# EAGLE design master_05 (EAGLE 5.06)
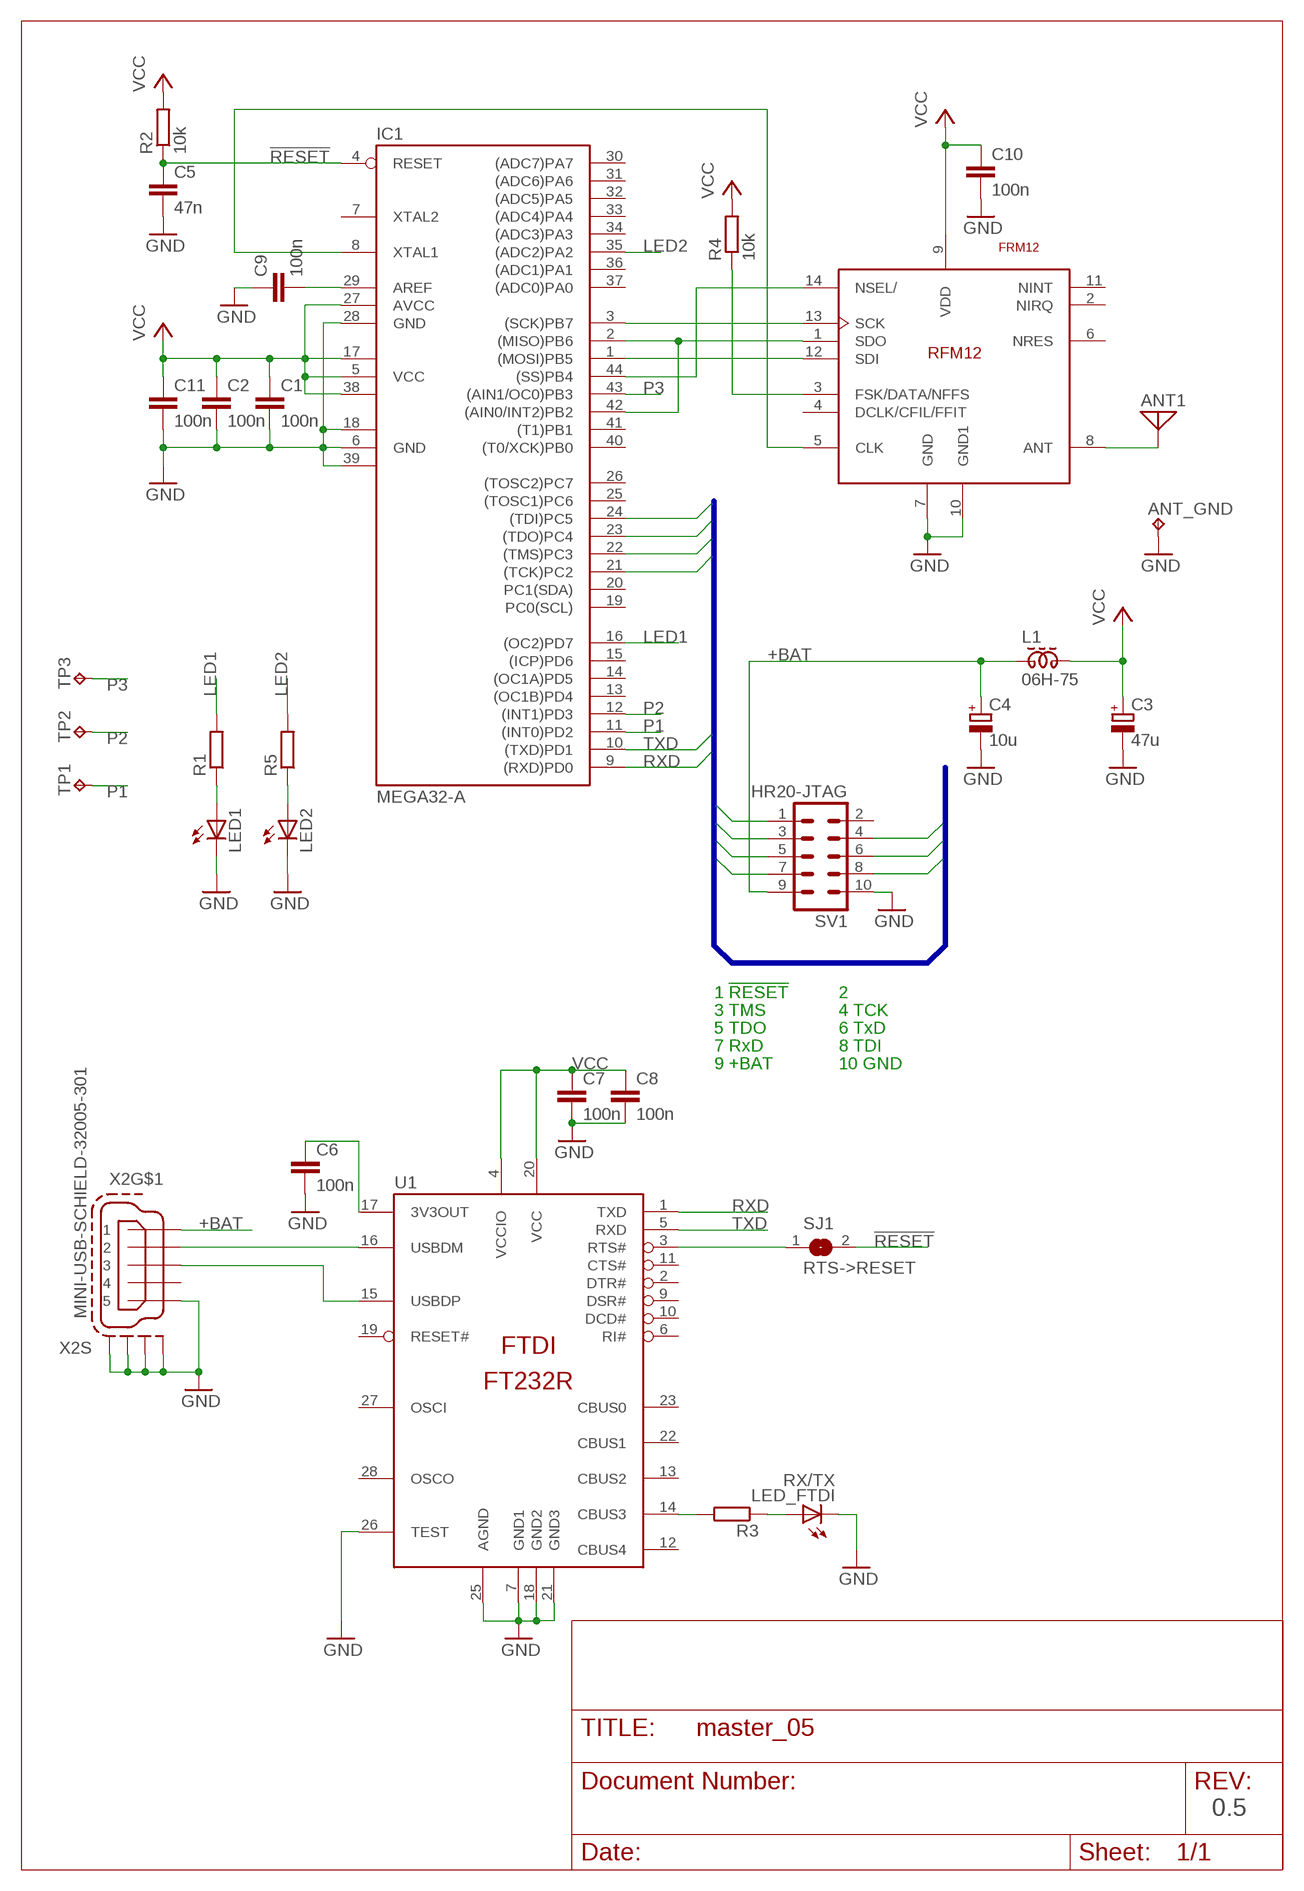
[diagram p0: schematic, sheet 1]

## Parts
ANT1  ANT  [PAD-01]
ANT_GND  TPTP20SQ  [TP20SQ]
C1  100n  C-EUC0603  [C0603]
C2  100n  C-EUC0603  [C0603]
C3  47u  CPOL-EUSMCD  [SMC_D]
C4  10u  CPOL-EUSMCD  [SMC_D]
C5  47n  C-EUC0603  [C0603]
C6  100n  C-EUC0603  [C0603]
C7  100n  C-EUC0603  [C0603]
C8  100n  C-EUC0603  [C0603]
C9  100n  C-EUC0603  [C0603]
C10  100n  C-EUC0603  [C0603]
C11  100n  C-EUC0603  [C0603]
IC1  MEGA32-A  [TQFP44]
L1  06H-75  ZD60820512  [ZD6-2W5]
LED1  LEDCHIPLED_0603  [CHIPLED_0603]
LED2  LEDCHIPLED_0603  [CHIPLED_0603]
LED_FTDI  RX/TX  LEDCHIPLED_0603  [CHIPLED_0603]
R1  R-EU_R0603  [R0603]
R2  10k  R-EU_R0603  [R0603]
R3  R-EU_R0603  [R0603]
R4  10k  R-EU_R0603  [R0603]
R5  R-EU_R0603  [R0603]
SJ1  RTS->RESET  SJ  [SJ]
SV1  HR20-JTAG  MA05-2  [MA05-2]
TP1  TP1-13  [P1-13]
TP2  TP1-13  [P1-13]
TP3  TP1-13  [P1-13]
U1  FT232RL  [SSOP28DB]
U$1  FRM12  [RFM12]
X2  MINI-USB-SCHIELD-32005-301  [32005-301]

## Nets
!RESET: C5.1 IC1.4(RESET) R2.1 SJ1.2 SV1.1
+BAT: C4.+ L1.1 SV1.9 X2.1
GND: ANT_GND.TP C1.2 C2.2 C3.- C4.- C5.2 C6.2 C7.2 C8.2 C9.1 C10.2 C11.2 IC1.6(GND) IC1.18(GND1) IC1.28(GND) IC1.39(GND2) LED1.C LED2.C LED_FTDI.C SV1.10 U1.7(GND1) U1.18(GND2) U1.21(GND3) U1.25(AGND) U1.26(TEST) U$1.7(GND) U$1.10(GND1) X2.5 X2.M1(S:S1) X2.M2(S:S2) X2.M3(S:S3) X2.M4(S:S4)
LED1: IC1.16((OC2)PD7) R1.2
LED2: IC1.35((ADC2)PA2) R5.2
N$1: IC1.2((MISO)PB6) IC1.42((AIN0/INT2)PB2) U$1.1(SDO)
N$2: IC1.1((MOSI)PB5) U$1.12(SDI)
N$3: IC1.3((SCK)PB7) U$1.13(SCK)
N$4: IC1.44((SS)PB4) U$1.14(NSEL/)
N$5: R4.1 U$1.3(FSK/DATA/NFFS)
N$6: IC1.8(XTAL1) U$1.5(CLK)
N$7: U1.16(USBDM) X2.2
N$8: U1.15(USBDP) X2.3
N$9: C6.1 U1.17(3V3OUT)
N$10: LED_FTDI.A R3.1
N$11: R3.2 U1.14(CBUS3)
N$12: LED1.A R1.1
N$13: LED2.A R5.1
N$14: SJ1.1 U1.3(RTS#)
N$15: C9.2 IC1.29(AREF)
N$17: ANT1.1(TP) U$1.8(ANT)
P1: IC1.11((INT0)PD2) TP1.1(TP)
P2: IC1.12((INT1)PD3) TP2.1(TP)
P3: IC1.43((AIN1/OC0)PB3) TP3.1(TP)
RXD: IC1.9((RXD)PD0) SV1.7 U1.1(TXD)
TCK: IC1.21((TCK)PC2) SV1.4
TDI: IC1.24((TDI)PC5) SV1.8
TDO: IC1.23((TDO)PC4) SV1.5
TMS: IC1.22((TMS)PC3) SV1.3
TXD: IC1.10((TXD)PD1) SV1.6 U1.5(RXD)
VCC: C1.1 C2.1 C3.+ C7.1 C8.1 C10.1 C11.1 IC1.5(VCC) IC1.17(VCC1) IC1.27(AVCC) IC1.38(VCC2) L1.2 R2.2 R4.2 U1.4(VCCIO) U1.20(VCC) U$1.9(VDD)
Unconnected: IC1.7(XTAL2) IC1.13((OC1B)PD4) IC1.14((OC1A)PD5) IC1.15((ICP)PD6) IC1.19(PC0(SCL)) IC1.20(PC1(SDA)) IC1.25((TOSC1)PC6) IC1.26((TOSC2)PC7) IC1.30((ADC7)PA7) IC1.31((ADC6)PA6) IC1.32((ADC5)PA5) IC1.33((ADC4)PA4) IC1.34((ADC3)PA3) IC1.36((ADC1)PA1) IC1.37((ADC0)PA0) IC1.40((T0/XCK)PB0) IC1.41((T1)PB1) SV1.2 U1.2(DTR#) U1.6(RI#) U1.9(DSR#) U1.10(DCD#) U1.11(CTS#) U1.12(CBUS4) U1.13(CBUS2) U1.19(RESET#) U1.22(CBUS1) U1.23(CBUS0) U1.27(OSCI) U1.28(OSCO) U$1.2(NIRQ) U$1.4(DCLK/CFIL/FFIT) U$1.6(NRES) U$1.11(NINT) X2.4

## Buses
IO:!RESET,TMS,TCK,TDO,TXD,RXD,TDI

## Notes on the sheet
- 1 !RESET | 2
- 3 TMS | 4 TCK
- 5 TDO | 6 TxD
- 7 RxD | 8 TDI
- 9 +BAT | 10 GND
- 0.5

## Library data of the parts
ANT1 = OpenHR20_master:ANT
ANT_GND = testpad:TP: Test pad
C1 C2 C5-C11 = resistor:C-EU: CAPACITOR, European symbol
C3 C4 = resistor:CPOL-EU: POLARIZED CAPACITOR, European symbol
IC1 = atmel:MEGA32: MICROCONTROLLER 32 Kbytes FLASH 2 Kbytes SRAM 1 Kbytes EEPROM USART 8-channel 10 bit ADC Source: www.atmel.com .. doc2503.pdf
L1 = OpenHR20_master:ZD60820512: WIDE-BAND CHOKE 2.5 windings
LED1 LED2 LED_FTDI = led:LED: LED OSRAM: - CHIPLED LG R971, LG N971, LY N971, LG Q971, LY Q971, LO R971, LY R971 LH N974, LH R974 LS Q976, LO Q976, LY Q976 LO Q996 - Hyper CHIPLED LW Q18S LB Q993, LB Q99A, LB R99A - SideLED LS A670, LO A670, LY A670, LG A670, LP A670 LB A673, LV A673, LT A673, LW A673 LH A674 LY A675 LS A676, LA A676, LO A676, LY A676, LW A676 LS A679, LY A679, LG A679 - Hyper Micro SIDELED® LS Y876, LA Y876, LO Y876, LY Y876 LT Y87S - SmartLED LW L88C, LW L88S LB L89C, LB L89S, LG L890 LS L89K, LO L89K, LY L89K LS L896, LA L896, LO L896, LY L896 - TOPLED LS T670, LO T670, LY T670, LG T670, LP T670 LSG T670, LSP T670, LSY T670, LOP T670, LYG T670 LG T671, LOG T671, LSG T671 LB T673, LV T673, LT T673, LW T673 LH T674 LS T676, LA T676, LO T676, LY T676, LB T676, LH T676, LSB T676, LW T676 LB T67C, LV T67C, LT T67C, LS T67K, LO T67K, LY T67K, LW E67C LS E67B, LA E67B, LO E67B, LY E67B, LB E67C, LV E67C, LT E67C LW T67C LS T679, LY T679, LG T679 LS T770, LO T770, LY T770, LG T770, LP T770 LB T773, LV T773, LT T773, LW T773 LH T774 LS E675, LA E675, LY E675, LS T675 LS T776, LA T776, LO T776, LY T776, LB T776 LHGB T686 LT T68C, LB T68C - Hyper Mini TOPLED® LB M676 - Mini TOPLED Santana® LG M470 LS M47K, LO M47K, LY M47K Source: http://www.osram.convergy.de LUXEON: - LUMILED® LXK2-PW12-R00, LXK2-PW12-S00, LXK2-PW14-U00, LXK2-PW14-V00 LXK2-PM12-R00, LXK2-PM12-S00, LXK2-PM14-U00 LXK2-PE12-Q00, LXK2-PE12-R00, LXK2-PE12-S00, LXK2-PE14-T00, LXK2-PE14-U00 LXK2-PB12-K00, LXK2-PB12-L00, LXK2-PB12-M00, LXK2-PB14-N00, LXK2-PB14-P00, LXK2-PB14-Q00 LXK2-PR12-L00, LXK2-PR12-M00, LXK2-PR14-Q00, LXK2-PR14-R00 LXK2-PD12-Q00, LXK2-PD12-R00, LXK2-PD12-S00 LXK2-PH12-R00, LXK2-PH12-S00 LXK2-PL12-P00, LXK2-PL12-Q00, LXK2-PL12-R00 Source: www.luxeon.com KINGBRIGHT: KA-3528ASYC Source: www.kingbright.com
R1-R5 = resistor:R-EU_: RESISTOR, European symbol
SJ1 = jumper:SJ: SMD solder JUMPER
SV1 = OpenHR20_master:MA05-2: PIN HEADER
TP1-TP3 = OpenHR20_master:TP
U1 = ftdichip-3:FT232RL: USB UART 4th Generation USB UART (USB <-> Serial) Controller
U$1 = RFM12:FRM12
X2 = con-cypressindustries:MINI-USB-SCHIELD-: MINI USB-B Conector Source: www.cypressindustries.com

## Board
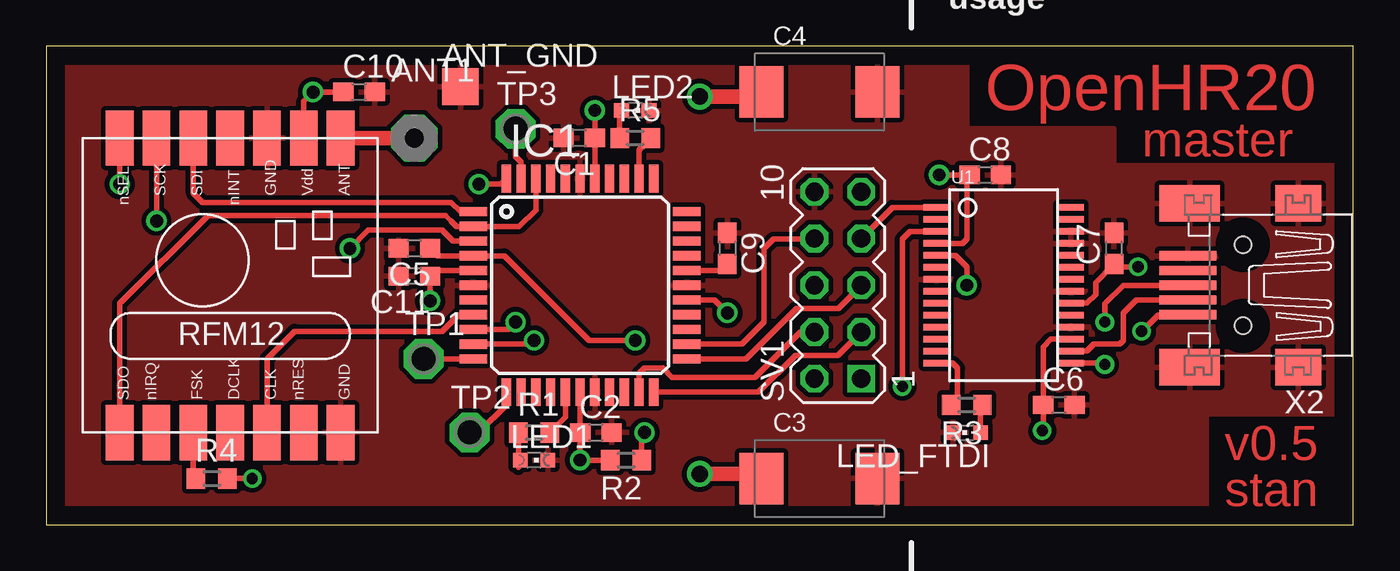
[diagram p1: board, top side]
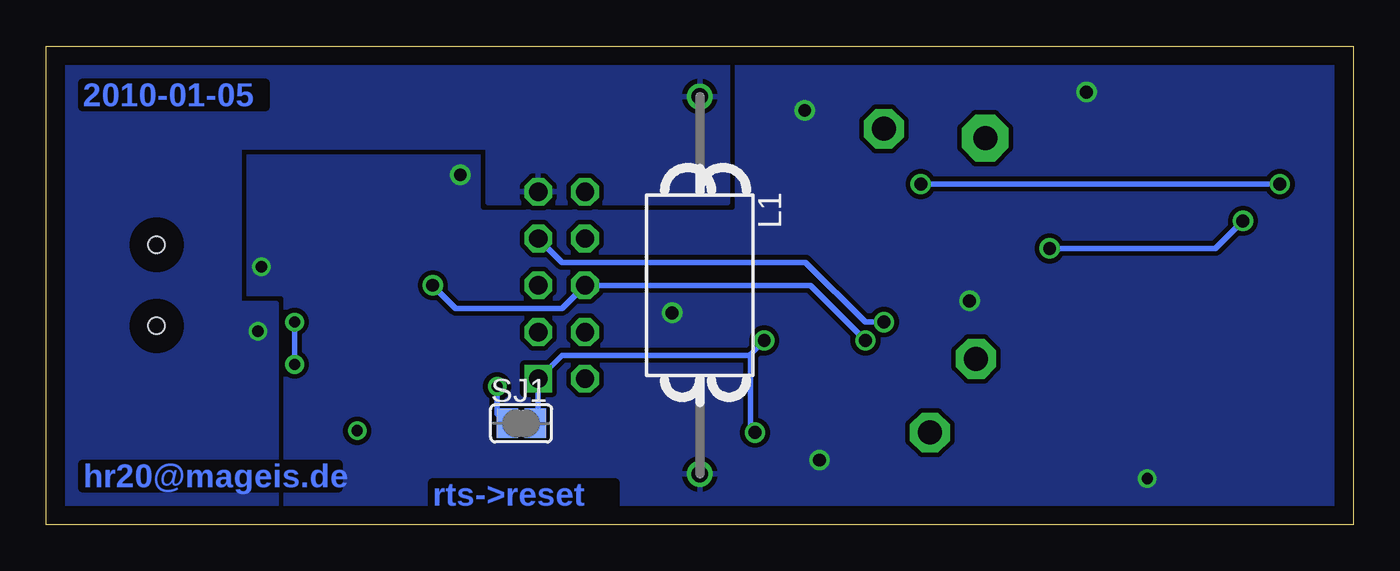
[diagram p2: board, bottom side, seen from below]

Size 71 x 26 mm. Coordinates in mm from the lower left corner, seen from the top.
Outline: 0,0 71,0 71,26 0,26 0,0
Copper layers (1*16): Top 0.035mm / dielectric 1.5mm / Bottom 0.035mm
Design rules "Olimex 10mils": minimum track width 10mil, minimum drill 24mil, track to track 10mil, track to pad 10mil, pad to pad 10mil, via to via 10mil, smd to smd 10mil, copper to edge 40mil, drill to drill 10mil, minimum pad ring 10mil, minimum via ring 8mil, stop-mask expansion 0mil, vias tented up to drill 0mil, thermal gap 10mil

### Footprints (pad centres in the part's own frame; a part is rotated, then mirrored left to right if it is on the bottom)
PAD-01 = drill 1.3 pad 2.54 octagon: 1 0,0
TP20SQ = smd 2 x 2: TP 0,0
C0603 = smd 1.1 x 1: 1 -0.85,0; 2 0.85,0
SMC_D = smd 2.4 x 2.8: + -3.15,0; - 3.15,0
TQFP44 = smd 1.5 x 0.5: 1 -5.8,4; 2 -5.8,3.2; 3 -5.8,2.4; 4 -5.8,1.6; 5 -5.8,0.8; 6 -5.8,0; 7 -5.8,-0.8; 8 -5.8,-1.6; 9 -5.8,-2.4; 10 -5.8,-3.2; 11 -5.8,-4; 23 5.8,-4; 24 5.8,-3.2; 25 5.8,-2.4; 26 5.8,-1.6; 27 5.8,-0.8; 28 5.8,0; 29 5.8,0.8; 30 5.8,1.6; 31 5.8,2.4; 32 5.8,3.2; 33 5.8,4 | smd 0.5 x 1.5: 12 -4,-5.8; 13 -3.2,-5.8; 14 -2.4,-5.8; 15 -1.6,-5.8; 16 -0.8,-5.8; 17 0,-5.8; 18 0.8,-5.8; 19 1.6,-5.8; 20 2.4,-5.8; 21 3.2,-5.8; 22 4,-5.8; 34 4,5.8; 35 3.2,5.8; 36 2.4,5.8; 37 1.6,5.8; 38 0.8,5.8; 39 0,5.8; 40 -0.8,5.8; 41 -1.6,5.8; 42 -2.4,5.8; 43 -3.2,5.8; 44 -4,5.8
ZD6-2W5 = drill 0.9 round: 1 -10.255,0; 2 10.255,0
CHIPLED_0603 = smd 0.8 x 0.8: A 0,-0.75; C 0,0.75
R0603 = smd 1 x 1.1: 1 -0.85,0; 2 0.85,0
SJ = smd 1.168 x 1.6: 1 -0.762,0; 2 0.762,0
MA05-2 = drill 1 square: 1 -5.08,-1.27 | drill 1 octagon: 2 -5.08,1.27; 3 -2.54,-1.27; 4 -2.54,1.27; 5 0,-1.27; 6 0,1.27; 7 2.54,-1.27; 8 2.54,1.27; 9 5.08,-1.27; 10 5.08,1.27
P1-13 = drill 1.3 pad 2.159 octagon: 1 0,0
SSOP28DB = smd 0.348 x 1.397: 1 -4.225,-3.656; 2 -3.575,-3.656; 3 -2.925,-3.656; 4 -2.275,-3.656; 5 -1.625,-3.656; 6 -0.975,-3.656; 7 -0.325,-3.656; 8 0.325,-3.656; 9 0.975,-3.656; 10 1.625,-3.656; 11 2.275,-3.656; 12 2.925,-3.656; 13 3.575,-3.656; 14 4.225,-3.656; 15 4.225,3.656; 16 3.575,3.656; 17 2.925,3.656; 18 2.275,3.656; 19 1.625,3.656; 20 0.975,3.656; 21 0.325,3.656; 22 -0.325,3.656; 23 -0.975,3.656; 24 -1.625,3.656; 25 -2.275,3.656; 26 -2.925,3.656; 27 -3.575,3.656; 28 -4.225,3.656
RFM12 = smd 1.5 x 3: 1 -5,-10; 2 -3,-10; 3 -1,-10; 4 1,-10; 5 3,-10; 6 5,-10; 7 7,-10; 8 7,6; 9 5,6; 10 3,6; 11 1,6; 12 -1,6; 13 -3,6; 14 -5,6
32005-301 = smd 3.1 x 0.5: 1 3,1.6; 2 3,0.8; 3 3,0; 4 3,-0.8; 5 3,-1.6 | smd 2.5 x 2: M1 -3,-4.45; M2 -3,4.45 | smd 3.3 x 2: M3 2.9,4.45; M4 2.9,-4.45 | hole 0.9: 0,2.2; 0,-2.2

### Placement (x,y rotation side)
ANT1  20,21 0 top
ANT_GND  22.5,23.8 0 top
C1  28.95,21 180 top
C2  29.86,5 0 top
C3  42,2.5 0 top
C4  42,23.5 0 top
C5  20,15 180 top
C6  55,6.5 0 top
C7  58,15 90 top
C8  51,19 0 top
C9  37,15 270 top
C10  17,23.5 0 top
C11  20,13.5 180 top
IC1  29,13 0 top
L1  35.5,13 270 bottom
LED1  26.5,3.5 270 top
LED2  32,22.5 270 top
LED_FTDI  50,5 90 top
R1  26.5,5 0 top
R2  31.5,3.5 180 top
R3  50,6.5 180 top
R4  9,2.5 0 top
R5  32,21 0 top
SJ1  45.2,5.5 0 bottom
SV1  43,13 90 top
TP1  20.5,9 0 top
TP2  23,5 0 top
TP3  25.5,21.5 0 top
U1  52,13 270 top
U$1  9,15 0 top
X2  65,13 180 top

### Tracks (layer width: path | path; a pad name or v marks a point on that pad's centre or on a via)
!RESET  (via drill 0.7)
  Top 0.3: C5.1 21.25,14.6 IC1.4 24.9,14.6 29.5,10 v32,10 | R2.1 32.35,4.85 v32.5,5
  Bottom 0.3: v32,10 32.75,9.25 | 32.75,9.25 32.8,9.2 42.99,9.2 SV1.1 44.27,5.67 SJ1.2 | v32.5,5 32.75,5.25 32.75,9.25
+BAT  (via drill 0.61)
  Top 0.3: X2.1 60.4,11.4 v59.5,10.5
  Top 0.8: L1.1 38.1,23.25 C4.+
  pour Bottom (rank 2): 70.5,26 34,26 34,17.5 47,17.5 47,20.5 60.5,20.5 60.5,12 58.5,12 58.5,0 70.5,0
GND
  pour Top: 0,26 50,26 50,21.5 58,21.5 58,19.5 70.5,19.5 70.5,6 63,6 63,0 0,0
LED1
  Top 0.3: R1.2 28.2,5.85 IC1.16
LED2
  Top 0.3: IC1.35 32.2,20.35 R5.2
N$1
  Top 0.254: 21.7,16.8 22,16.5
  Top 0.3: U$1.1 4,12 8.8,16.8 21.7,16.8 | IC1.42 26.6,17.1 25.7,16.2 IC1.2 22.3,16.2 22,16.5
N$2
  Top 0.254: 22.5,17 IC1.1
  Top 0.3: U$1.12 8,18 8.5,17.5 22,17.5 22.5,17
N$3  (via drill 0.7)
  Top 0.3: IC1.3 22.1,15.4 21.5,16 17.5,16 v16.5,15 | v6,16.5 U$1.13
  Bottom 0.3: v6,16.5 7.5,15 v16.5,15
N$4  (via drill 0.7)
  Top 0.3: v4,18.5 U$1.14 | v23.5,18.5 24.7,18.5 IC1.44
  Bottom 0.3: v4,18.5 v23.5,18.5
N$5
  Top 0.3: U$1.3 8,2.15 R4.1
N$6
  Top 0.3: IC1.8 22.4,11.4 21.5,10.5 13.5,10.5 12,9 U$1.5
N$7
  Top 0.3: X2.2 59.2,12.2 58.5,11.5 58.5,10 58.3,9.8 56.9,9.8 56.52,9.43 U1.16
N$8  (via drill 0.61)
  Top 0.3: X2.3 58.5,13 57.5,12 v57.5,11 | U1.15 57.42,8.78 v57.5,8.7
  Bottom 0.3: v57.5,8.7 v57.5,11
N$9  (via drill 0.61)
  Top 0.3: U1.17 54.58,10.07 54.15,9.65 C6.1 54.15,5.15 v54.1,5.1
N$10
  Top 0.3: R3.1 50.75,6.4 LED_FTDI.A
N$11
  Top 0.3: U1.14 49.23,8.78 49.5,8.5 49.5,6.65 R3.2
N$12
  Top 0.3: R1.1 25.65,3.1 LED1.A
N$13
  Top 0.3: R5.1 31.15,22.4 LED2.A
N$14  (via drill 0.61)
  Top 0.3: U1.3 46.92,15.93 46.5,15.5 v46.5,7.5
  Bottom 0.3: v46.5,7.5 46.5,6 46.46,6 SJ1.1
N$15
  Top 0.3: IC1.29 36.65,13.8 C9.2
N$17
  Top 0.8: U$1.8 ANT1.1
P1
  Top 0.3: TP1.1 IC1.11
P2
  Top 0.3: IC1.12 25,6.5 23.5,5 TP2.1
P3
  Top 0.3: IC1.43 25.8,19.7 25.5,20 TP3.1
RXD  (via drill 0.7)
  Top 0.3: U1.1 45.95,17.23 SV1.7 | IC1.9 25.1,10.6 v25.5,11
  Bottom 0.3: SV1.7 42.98,14.25 30.5,14.25 29.75,14.25 26.5,11 v25.5,11
TCK
  Top 0.3: IC1.21 32.2,8.2 32.5,8.5 33.5,8.5 34,8 38.5,8 40.96,10.46 SV1.4
TDI
  Top 0.3: IC1.24 37.8,9.8 39,11 39,15 39.5,15.5 41.69,15.5 SV1.8
TDO
  Top 0.3: IC1.23 38,9 40.75,11.75 43.02,11.75 SV1.5
TMS
  Top 0.3: IC1.22 38.7,7.2 40.7,9.2 43.01,9.2 SV1.3
TXD  (via drill 0.7)
  Top 0.3: U1.5 49.38,14.62 50,14 v50,13 | IC1.10 26.3,9.8 v26.5,10
  Bottom 0.3: v50,13 48.75,11.75 42.98,11.75 SV1.6 29.5,13 v26.5,10
VCC  (via drill 0.61, 0.7)
  Top 0.3: v29,3.5 IC1.17 | v29,3.5 C2.1 | U1.20 56.52,12.03 57,12.5 57,13.15 C7.1 | U1.4 49.77,15.28 50,15.5 50,19 | IC1.27 36.3,12.2 v37,11.5 | IC1.38 C1.1 v29.8,22.5 | IC1.5 21.15,13.8 C11.1 v20.85,12.15 | U$1.9 14,23 v14.5,23.5 C10.1 | 50,19 v48.5,19 | v29,3.5 R2.2 | C7.1 58.25,14.4 | v59.3,14 58.15,14 C7.1 | R4.2 v11.2,2.5 | 50,19 C8.1
  Top 0.8: L1.2 38.1,2.75 C3.+
  pour Bottom (rank 3): 0,26 70.5,26 70.5,0 0,0

### Text on the board
Top: OpenHR20 | master | v0.5 | stan
Bottom: 2010-01-05 | hr20@mageis.de | rts->reset
tPlace: cut here | for non-USB | usage
tPrint: sync | ANT | 1 | RX/TX